# Altium schematic sheet Speaker.SchDoc
size A; SheetNumber: 11; SheetTotal: 11
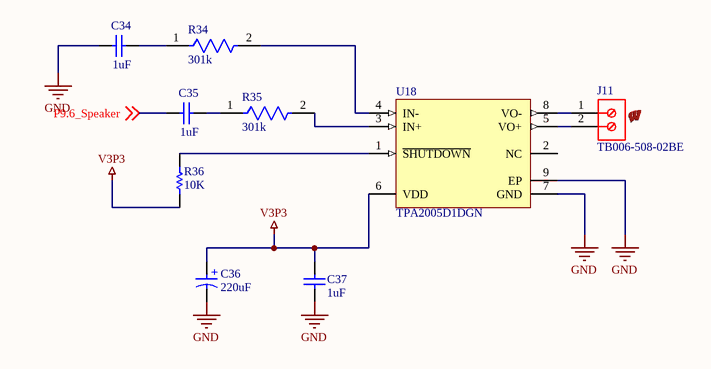
[diagram p0: Speaker.SchDoc]

## Parts
C34  1uF  [CAPC2013X145X50NL20T25]
C35  1uF  [CAPC2013X145X50NL20T25]
C36  220uF  [WCAP-AS5H_D6.3H7.7]
C37  1uF  [CAPC2013X145X50NL20T25]
J11  Manufacturer Part Number: TB006-508-02BE  [CUI_TB006 -508-02BE]  (hidden comment: CONN_TB006_-508-02BE)
R34  301k  [FP-CRCW1206-Pe3-MFG]
R35  301k  [FP-CRCW1206-Pe3-MFG]
R36  10K  [RESC2013X55X40ML15T20]
U18  TPA2005D1DGN  [DGN0008D_L]

## Nets
GND: C34.1 C36.2(N) C37.1 U18.7(GND) U18.9(EP)
V3P3: C36.1(P) C37.2 R36.1 U18.6(VDD)
P9.6_Speaker: C35.1 ; off-sheet P9.6_Speaker
NetC34_2: C34.2 R34.1
NetC35_2: C35.2 R35.1
NetJ11_1: J11.1 U18.8(VO-)
NetJ11_2: J11.2 U18.5(VO+)
NetR34_2: R34.2 U18.4(IN-)
NetR35_2: R35.2 U18.3(IN+)
NetR36_2: R36.2 U18.1(~{SHUTDOWN})

Not connected (* = marked no-connect by the designer): U18 2(NC)

## Notes on the sheet
- (in symbol CMP-03913-53914664-1) +

## Library data of the parts
C34 C35 C37 = CMP-2007-01227-1: Manufacturer: Kemet; Part Number: C0805S104K5RACTU
C36 = CMP-03913-53914664-1: 865230145005 WCAP-AS5H Aluminum Electrolytic Capacitors; Insulation Resistance: 454.545kΩ; Ripple Current (AC): 110mA; Leakage Current: 13.86µA; Life (Hours): 5000hours; Voltage Rating (DC): 6.3V; Capacitance: 220µF; Ripple Current: 110mA; Diameter: 6.3mm; NexarPartId: 53914664; Packaging: Cut Tape; Height: 7.7mm; Max Operating Temperature: 105°C; REACH SVHC: Unknown; RoHS: Compliant; Width: 6.6mm; Length: 7.7mm; Case/Package: Radial; Voltage Rating: 6.3V; Min Operating Temperature: -40°C
J11 = CONN_TB006_-508-02BE: 2~24 Poles, Screw Type, Horizontal, 5.08 Pitch, 26~14 (AWG), Terminal Block Connector; MF: CUI Devices; MP: TB006 -508-02BE; CUI_purchase_URL: https://www.cuidevices.com/product/interconnect/connectors/terminal-blocks/tb006-508-series?utm_source=snapeda.com&utm_medium=referral&utm_campaign=snapedaBOM; Value: *; Check_prices: https://www.snapeda.com/parts/TB006%20-508-02BE/CUI+Devices/view-part/?ref=eda; SnapEDA_Link: https://www.snapeda.com/parts/TB006%20-508-02BE/CUI+Devices/view-part/?ref=snap; Availability: In Stock; Package: None; Purchase-URL: https://pricing.snapeda.com/search/part/TB006 -508-02BE/?ref=eda; Price: None; Supplier: Digikey; Supplier Part Number: 102-6191-ND; Manufacturer: CUI Devices; RoHS: Yes; Category: Terminal Blocks; Stock: 47249; Pricing: 1=0.73, 10=0.402, 25=0.3, 50=0.2676, 100=0.2623, 250=0.23084, 500=0.20984, 1000=0.18886, 5000=0.14164 (USD)
R34 R35 = CMP-03613-000233-1: RES Thick Film, 301kΩ, 1%, 0.25W, 50ppm/°C, 1206; Resistance: 301kR; Max Power Dissipation: 250mW; Number of Terminations: 2; Series: CRCW-P; Resistor Type: Thick Film; RoHS Compliant: Yes; Max Operating Temperature: 155°C; Features: Automotive AEC-Q200; Case/Package: 1206; Packaging: Tape and Reel; Package Quantity: 5000; Tolerance: 1%; Min Operating Temperature: -55°C; Temperature Coefficient: 50ppm/°C; Width: 0.063inch; Height: 0.024inch; Length: 0.126inch
R36 = CMP-2001-04711-1: Part Number: TNPW0805301KBEEN; Manufacturer: Vishay Dale
U18 = CMP-0991-00091-2: 1.4-W Mono Class-D Audio Amplifier, -40 to 85 degC, 8-pin SOP (DGN8), Green (RoHS & no Sb/Br); Manufacturer: Texas Instruments; Supply Min(Min)(Volt): 2.5; SubFamily: Dynamic Speaker; Supply Max(Max)(Volt): 5.5; Output Power(W): 1.18; PSRR(dB): -75; ComponentLink1Description: Manufacturer URL; Mounting Technology: Surface Mount; Code_JEDEC: MO-187; PackageReference: DGN0008D; PackageDescription: 8-Pin Plastic Small Outline, Body 3 x 3 mm, Pitch 0.65 mm; Eco-Plan: Green (RoHS & no Sb/Br); ComponentLink3Description: Package Specification; ComponentLink1URL: http://www.ti.com/; PackageVersion: 4073271/F, 05/2011; ComponentLink2Description: Datasheet; DatasheetVersion: SLOS369F; Speaker Amp Type: Class-D; Speaker Channels: Mono; PartNumber: TPA2005D1DGN; ComponentLink3URL: http://www.ti.com/litv/pdf/mpds046e; ComponentLink2URL: http://www.ti.com/general/docs/lit/getliterature.tsp?genericPartNumber=TPA2005D1&fileType=pdf